# Altium schematic sheet Carte E3e Projet CAERUS etudiant ABD.SchDoc
size A4; SheetNumber: 1; SheetTotal: 1
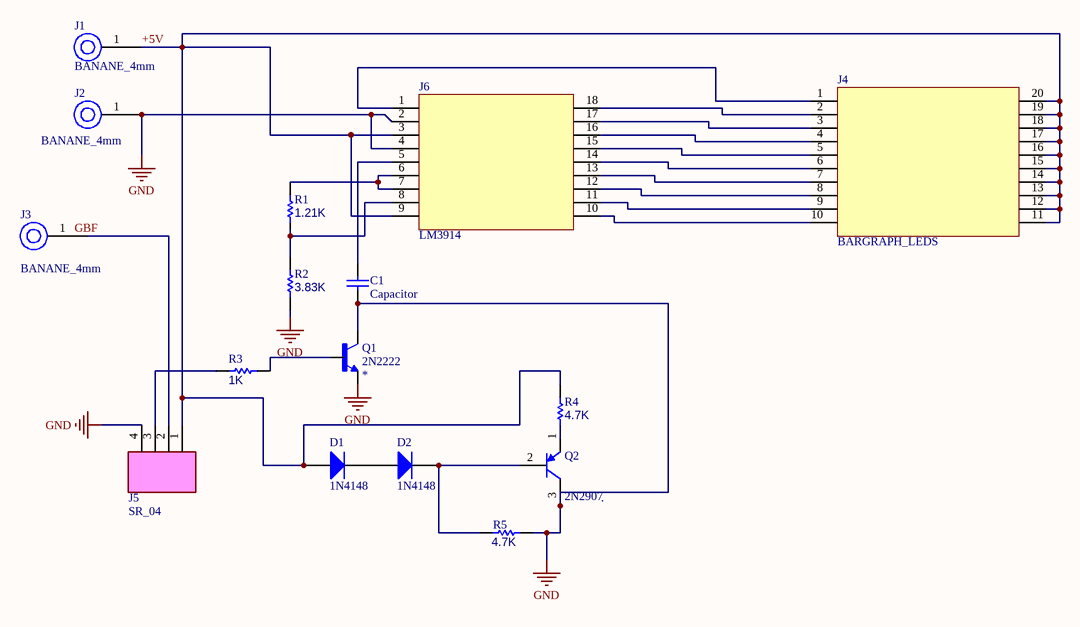
[diagram p0: Carte E3e Projet CAERUS etudiant ABD.SchDoc]

## Parts
C1  Condensateur  [C0805_N]  (value not drawn)
D1  1N4148  [NXP-SOD27-2_V]
D2  1N4148  [NXP-SOD27-2_V]
J1  Type: BANANE_4mm  [DOUILLE_BANANE_4mm]  (hidden comment: DOUILLE BANANE 4mm)
J2  Type: BANANE_4mm  [DOUILLE_BANANE_4mm]  (hidden comment: DOUILLE BANANE 4mm)
J3  Type: BANANE_4mm  [DOUILLE_BANANE_4mm]
J4  Type: BARGRAPH_LEDS  [DIP20_PAS=2.54_LARG=7.62_LONG=25.6]  (hidden comment: COMPOSANT_20_BROCHES)
J5  Type: SR_04  [BARRETTE_4_F_D]  (hidden comment: BARRETTE_4 CONTACTS_1 RANGEE_FEMELLE_DROITE)
J6  Type: LM3914  [DIP18_PAS=2.54_LARG=7.62_LONG=23]  (hidden comment: COMPOSANT_18_BROCHES)
Q1  2N2222  [TO127P584H533-3]
Q2  .  Type: 2N2907  [TRANSISTOR_BIPOL_TO18_EBC]
R1  value 1.21K  [RESISTANCE_1/2W]  (hidden comment: RESISTANCE_AXIALE_1/4W)
R2  value 3.83K  [RESISTANCE_1/2W]  (hidden comment: RESISTANCE_AXIALE_1/4W)
R3  value 1K  [RESISTANCE_1/2W]  (hidden comment: RESISTANCE_AXIALE_1/4W)
R4  value 4.7K  [RESISTANCE_1W]  (hidden comment: RESISTANCE_AXIALE_1W)
R5  value 4.7K  [RESISTANCE_1W]  (hidden comment: RESISTANCE_AXIALE_1W)

## Nets
GND: C1.1 J2.1 J5.4 J6.2 J6.4 Q1.1(E) Q1.3(C) Q2.3(C) R2.1 R5.2
+5V: D1.1(A) J1.1 J4.11 J4.12 J4.13 J4.14 J4.15 J4.16 J4.17 J4.18 J4.19 J4.20 J5.1 J6.3 J6.9 R4.2
NetC1_2: C1.2 J6.5
NetD1_2: D1.2(K) D2.1(A)
NetD2_2: D2.2(K) Q2.2(B) R5.1
NetJ3_1: J3.1 J5.2
NetJ4_1: J4.1 J6.1
NetJ4_2: J4.2 J6.18
NetJ4_3: J4.3 J6.17
NetJ4_4: J4.4 J6.16
NetJ4_5: J4.5 J6.15
NetJ4_6: J4.6 J6.14
NetJ4_7: J4.7 J6.13
NetJ4_8: J4.8 J6.12
NetJ4_9: J4.9 J6.11
NetJ4_10: J4.10 J6.10
NetJ5_3: J5.3 R3.1
NetJ6_6: J6.6 J6.7 R1.2
NetJ6_8: J6.8 R1.1 R2.2
NetQ1_2: Q1.2(B) R3.2
NetQ2_1: Q2.1(E) R4.1

## Notes on the sheet
- (near J3) GBF

## Library data of the parts
C1 = CMP-001-00229-1: Capacitor; LatestRevisionNote: Re-released for DXP Platform.; Design Item ID: Condensateur; LatestRevisionDate: 17-Jul-2002; Source: robot_eseo.SchLib; Case/Package: RAD-0.3; Type: Capacitor; Publisher: Altium Limited; Published: 8-Jun-2000
D1 D2 = CMP-004-00000-2: High Speed Diode, 100 V, 0.45 A, -65 to 175 degC, 2-Pin SOD27, RoHS, Bulk; Manufacturer: Fairchild; Elements: 1; Recovery Time: 4ns; Forward Current: 300mA; Power: 500mW; Forward Voltage: 1V; Max Surge Current: 4A; Peak Reverse Current: 5uA; Datasheet URL: http://www.nxp.com/documents/data_sheet/1N4148_1N4448.pdf; Min Operating Temperature: -65°C; Manufacturer URL: https://www.fairchildsemi.com/; Packaging: Bulk; Diameter: 1.91mm; Pins: 2; Package URL: http://www.nxp.com/documents/data_sheet/1N4148_1N4448.pdf; Package Reference: SOD27; Max Operating Temperature: 175°C; Package Quantity: 2000; Case/Package: DO; Datasheet Version: Aug-04; RoHS Compliant: True
J1 J2 = DOUILLE_BANANE_4mm: DOUILLE BANANE 4 mm
J3 = CMP-118-000026-1: DOUILLE BANANE 4 mm; Design Item ID: DOUILLE_BANANE_4mm; Source: connecteurs.SchLib
J4 = SYMBOLE_COMPOSANT_20_BROCHES
J5 = BARRETTE_4 CONTACTS_1 RANGEE_FEMELLE_DROITE: BARRETTE 4 CONTACTS 1 RANGEE FEMELLE DROITE
J6 = SYMBOLE_COMPOSANT_18_BROCHES
Q1 = CMP-148-000000-1: Bipolar (BJT) Transistor NPN 50V 800mA 300mW Surface Mount Ceramic SMD; MF: ON Semiconductor; MP: 2N2222; Price: None; Value: *; Component Type: Standard; Purchase-URL: https://pricing.snapeda.com/search/part/2N2222/?ref=eda; Availability: In Stock; SnapEDA_Link: https://www.snapeda.com/parts/2N2222/Onsemi/view-part/?ref=snap; Pin Count: 3; Design Item ID: 2N2222; Source: 2N2222.SchLib
Q2 = CMP-328-000034-1: TRANSISTOR PNP TO18_EBC : 2N2907; Source: composants actifs.SchLib; Design Item ID: TRANSISTOR_PNP_TO18_EBC : 2N2907
R1-R3 = RESISTANCE_AXIALE_1/4W: RESISTANCE TRAVERSANTE AXIALE 1/4W
R4 R5 = CMP-009-00186-1: RESISTANCE TRAVERSANTE AXIALE 1W; Source: composants passifs.SchLib; Design Item ID: RESISTANCE_AXIALE_1W